# EAGLE design R2P_Sonar_module (EAGLE 6.2)
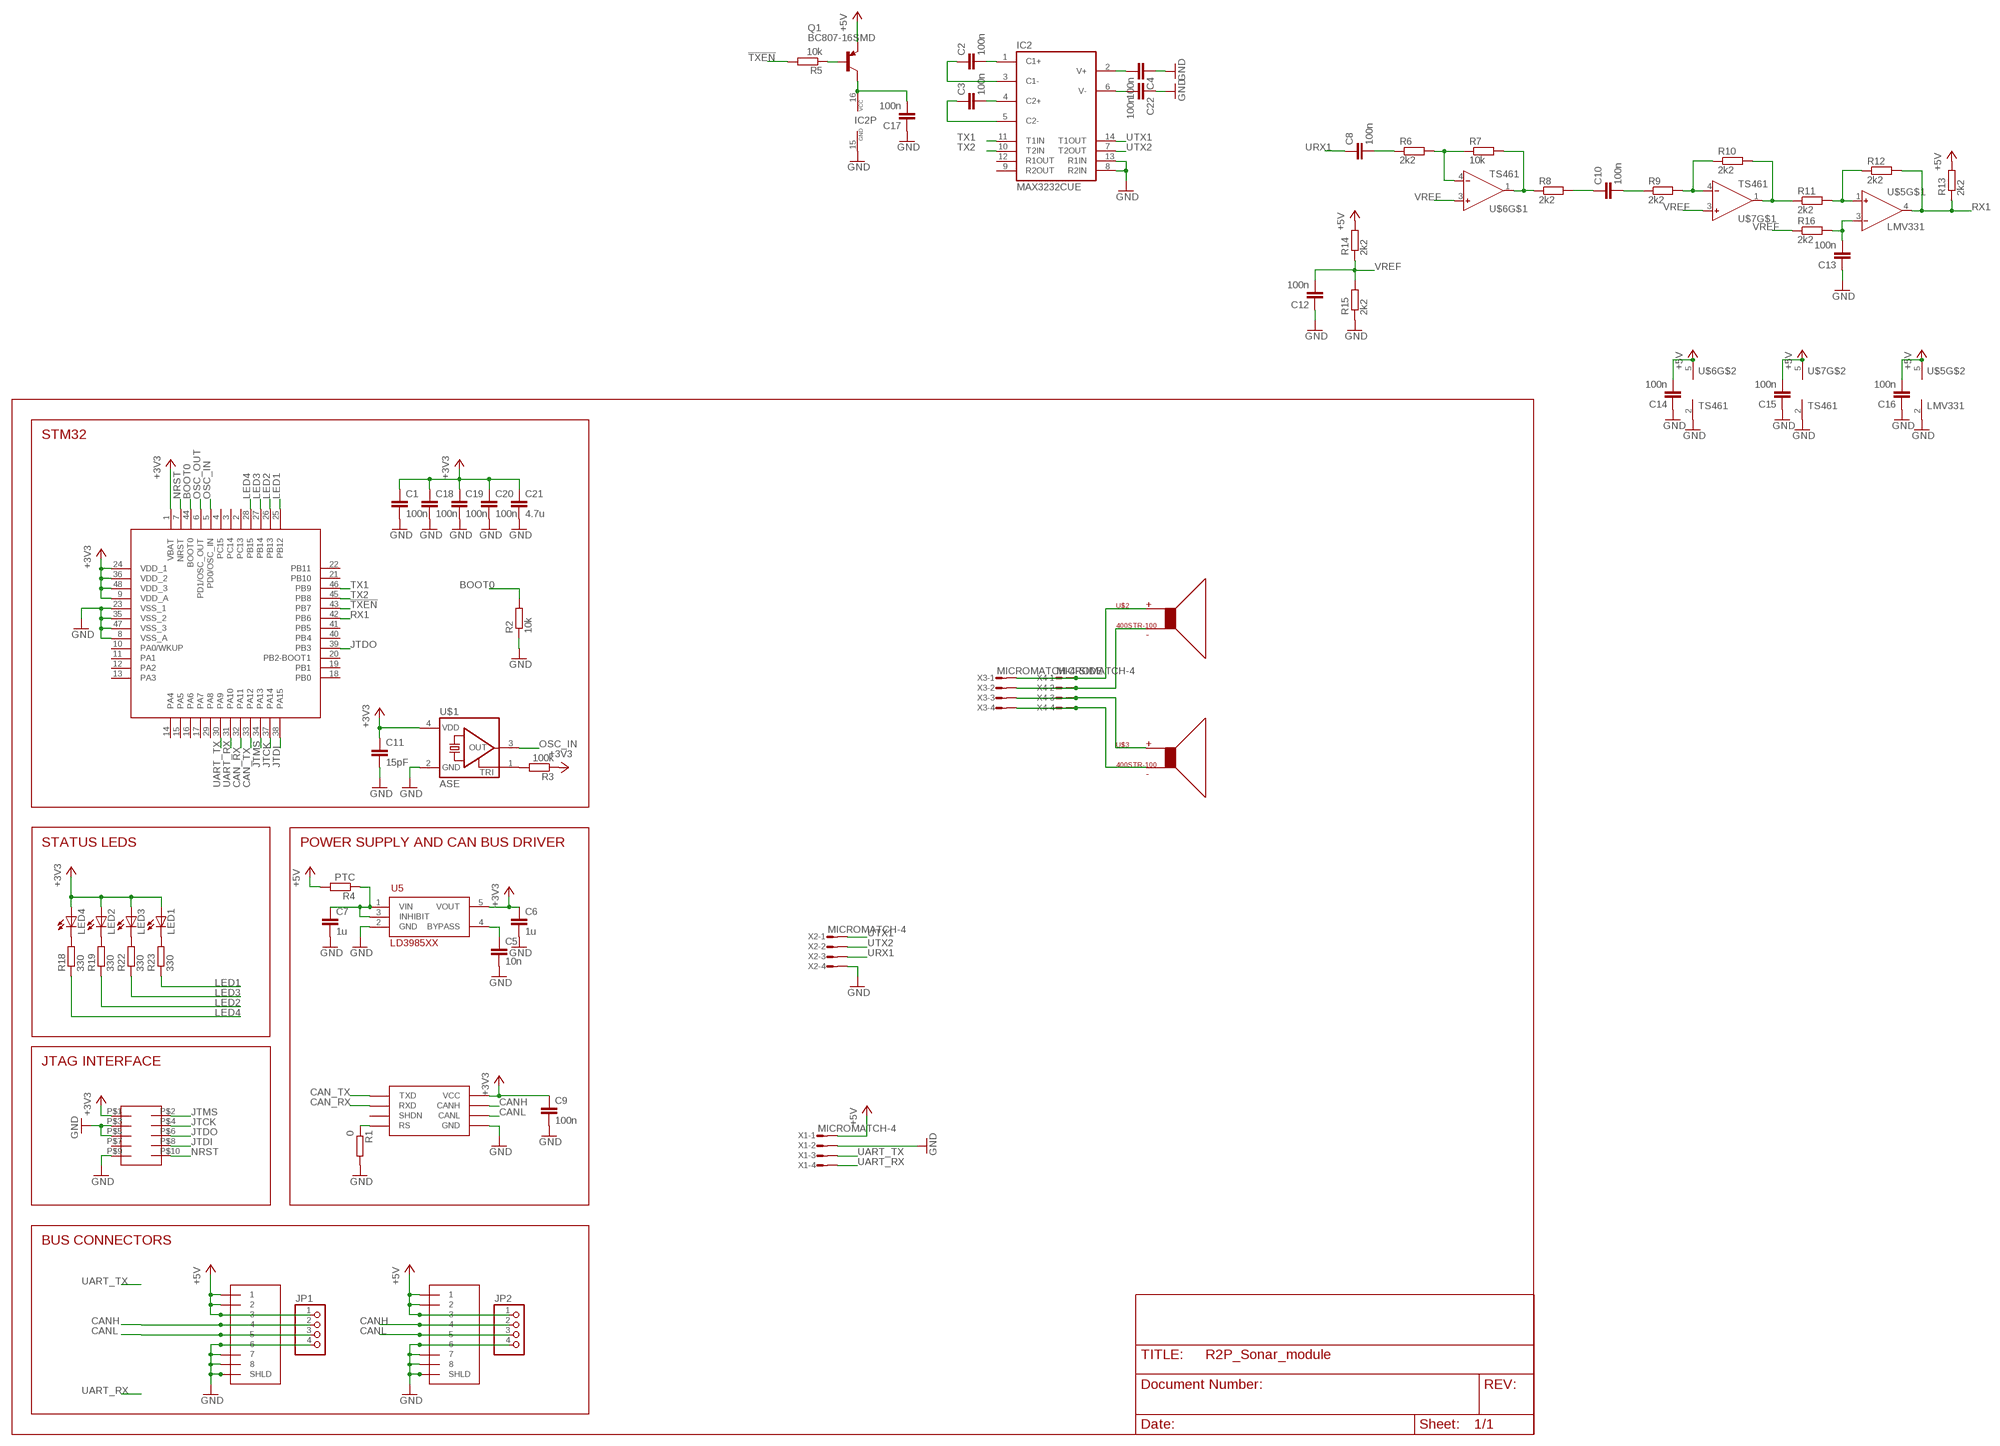
[diagram p0: schematic, sheet 1]

## Parts
1  RJ45-43860  [0438600010]
2  RJ45-43860  [0438600010]
C1  100n  C-EUC0603  [C0603]
C2  100n  C-EUC0603  [C0603]
C3  100n  C-EUC0603  [C0603]
C4  100n  C-EUC0603  [C0603]
C5  10n  C-EUC0603  [C0603]
C6  1u  C-EUC0603  [C0603]
C7  1u  C-EUC0603  [C0603]
C8  100n  C-EUC0603  [C0603]
C9  100n  C-EUC0603  [C0603]
C10  100n  C-EUC0603  [C0603]
C11  15pF  C-EUC0603  [C0603]
C12  100n  C-EUC0603  [C0603]
C13  100n  C-EUC0603  [C0603]
C14  100n  C-EUC0603  [C0603]
C15  100n  C-EUC0603  [C0603]
C16  100n  C-EUC0603  [C0603]
C17  100n  C-EUC0603  [C0603]
C18  100n  C-EUC0603  [C0603]
C19  100n  C-EUC0603  [C0603]
C20  100n  C-EUC0603  [C0603]
C21  4.7u  C-EUC0805  [C0805]
C22  100n  C-EUC0603  [C0603]
IC2  MAX3232CUE  [TSSOP16]
JP1  PINHD-1X4  [1X04]
JP2  PINHD-1X4  [1X04]
LED1  LEDCHIPLED_0805  [CHIPLED_0805]
LED2  LEDCHIPLED_0805  [CHIPLED_0805]
LED3  LEDCHIPLED_0805  [CHIPLED_0805]
LED4  LEDCHIPLED_0805  [CHIPLED_0805]
Q1  BC807-16SMD  [SOT23-BEC]
R1  0  R-EU_R0603  [R0603]
R2  10k  R-EU_R0603  [R0603]
R3  100k  R-EU_R0603  [R0603]
R4  PTC  R-EU_R0603  [R0603]
R5  10k  R-EU_R0603  [R0603]
R6  2k2  R-EU_R0603  [R0603]
R7  10k  R-EU_R0603  [R0603]
R8  2k2  R-EU_R0603  [R0603]
R9  2k2  R-EU_R0603  [R0603]
R10  2k2  R-EU_R0603  [R0603]
R11  2k2  R-EU_R0603  [R0603]
R12  2k2  R-EU_R0603  [R0603]
R13  2k2  R-EU_R0603  [R0603]
R14  2k2  R-EU_R0603  [R0603]
R15  2k2  R-EU_R0603  [R0603]
R16  2k2  R-EU_R0603  [R0603]
R18  330  R-EU_R0603  [R0603]
R19  330  R-EU_R0603  [R0603]
R22  330  R-EU_R0603  [R0603]
R23  330  R-EU_R0603  [R0603]
SOT1  MAX3051  [SOT23-8L]
U1  STM32F103CX  [LQFP48]
U5  LD3985XX  [SOT23-5L]
U$1  ASE  [ASE]
U$2  400STR-100  [400STR100]
U$3  400STR-100  [400STR100]
U$4  FTSH-105  [FTSH-105]
U$5  LMV331  [SOT23-5L]
U$6  TS461  [SOT23-5L]
U$7  TS461  [SOT23-5L]
X1  MICROMATCH-4  [MICROMATCH-4]
X2  MICROMATCH-4  [MICROMATCH-4]
X3  MICROMATCH-4-SIDE  [MICROMATCH-4-SIDE]
X4  MICROMATCH-4  [MICROMATCH-4]

## Nets
!TXEN: R5.2 U1.43(PB7)
+3V3: C1.1 C6.1 C9.1 C11.1 C18.1 C19.1 C20.1 C21.1 LED1.A LED2.A LED3.A LED4.A R3.1 SOT1.P$3(VCC) U1.1(VBAT) U1.9(VDD_A) U1.24(VDD_1) U1.36(VDD_2) U1.48(VDD_3) U5.5(VOUT) U$1.4(VDD) U$4.P$1
+5V: 1.P$1 1.P$2 1.P$3 2.P$1 2.P$2 2.P$3 C14.2 C15.2 C16.2 JP1.1 JP2.1 Q1.E R4.2 R13.2 R14.2 U$5.5(V+) U$6.5(V+) U$7.5(V+) X1.1
BOOT0: R2.2 U1.44(BOOT0)
CAN_RX: SOT1.P$4(RXD) U1.32(PA11)
CAN_TX: SOT1.P$1(TXD) U1.33(PA12)
CANH: 1.P$4 2.P$4 JP1.2 JP2.2 SOT1.P$7(CANH)
CANL: 1.P$5 2.P$5 JP1.3 JP2.3 SOT1.P$6(CANL)
GND: 1.P$6 1.P$7 1.P$8 1.P$9(SHLD) 1.P$10 2.P$6 2.P$7 2.P$8 2.P$9(SHLD) 2.P$10 C1.2 C4.1 C5.2 C6.2 C7.2 C9.2 C11.2 C12.1 C13.1 C14.1 C15.1 C16.1 C17.1 C18.2 C19.2 C20.2 C21.2 C22.1 IC2.8(R2IN) IC2.13(R1IN) IC2.15(GND) JP1.4 JP2.4 R1.2 R2.1 R15.1 SOT1.P$2(GND) U1.8(VSS_A) U1.23(VSS_1) U1.35(VSS_2) U1.47(VSS_3) U5.2(GND) U$1.2(GND) U$4.P$3 U$4.P$5 U$4.P$9 U$5.2(V-) U$6.2(V-) U$7.2(V-) X1.2 X2.4
JTCK: U1.37(PA14) U$4.P$4
JTDI: U1.38(PA15) U$4.P$8
JTDO: U1.39(PB3) U$4.P$6
JTMS: U1.34(PA13) U$4.P$2
LED1: R23.1 U1.25(PB12)
LED2: R19.1 U1.26(PB13)
LED3: R22.1 U1.27(PB14)
LED4: R18.1 U1.28(PB15)
N$2: R1.1 SOT1.P$8(RS)
N$3: R3.2 U$1.1(TRI)
N$4: C5.1 U5.4(BYPASS)
N$5: C7.1 R4.1 U5.1(VIN) U5.3(INHIBIT)
N$6: C2.2 IC2.1(C1+)
N$7: C2.1 IC2.3(C1-)
N$8: C3.2 IC2.4(C2+)
N$9: C3.1 IC2.5(C2-)
N$10: C17.2 IC2.16(VCC) Q1.C
N$11: C8.2 R6.1
N$12: U$2.P$1 X3.1 X4.1
N$13: U$2.P$2 X3.2 X4.2
N$14: U$3.P$1 X3.3 X4.3
N$15: LED4.C R18.2
N$16: U$3.P$2 X3.4 X4.4
N$17: Q1.B R5.1
N$18: LED2.C R19.2
N$20: LED3.C R22.2
N$21: R6.2 R7.1 U$6.4(IN-)
N$22: LED1.C R23.2
N$23: R7.2 R8.1 U$6.1(OUT)
N$24: C10.1 R8.2
N$25: C10.2 R9.1
N$26: R9.2 R10.1 U$7.4(IN-)
N$27: R10.2 R11.1 U$7.1(OUT)
N$28: R11.2 R12.1 U$5.1(IN+)
N$29: C4.2 IC2.2(V+)
N$30: C13.2 R16.2 U$5.3(IN-)
N$31: C22.2 IC2.6(V-)
NRST: U1.7(NRST) U$4.P$10
OSC_IN: U1.5(PD0/OSC_IN) U$1.3(OUT)
OSC_OUT: U1.6(PD1/OSC_OUT)
RX1: R12.2 R13.1 U1.42(PB6) U$5.4(OUT)
TX1: IC2.11(T1IN) U1.46(PB9)
TX2: IC2.10(T2IN) U1.45(PB8)
UART_RX: U1.31(PA10) X1.4
UART_TX: U1.30(PA9) X1.3
URX1: C8.1 X2.3
UTX1: IC2.14(T1OUT) X2.1
UTX2: IC2.7(T2OUT) X2.2
VREF: C12.2 R14.1 R15.2 R16.1 U$6.3(IN+) U$7.3(IN+)
Unconnected: IC2.9(R2OUT) IC2.12(R1OUT) SOT1.P$5(SHDN) U1.2(PC13) U1.3(PC14) U1.4(PC15) U1.10(PA0/WKUP) U1.11(PA1) U1.12(PA2) U1.13(PA3) U1.14(PA4) U1.15(PA5) U1.16(PA6) U1.17(PA7) U1.18(PB0) U1.19(PB1) U1.20(PB2-BOOT1) U1.21(PB10) U1.22(PB11) U1.29(PA8) U1.40(PB4) U1.41(PB5) U$4.P$7

## Notes on the sheet
- STM32
- STATUS LEDS | POWER SUPPLY AND CAN BUS DRIVER
- JTAG INTERFACE
- BUS CONNECTORS

## Library data of the parts
1 2 = molex:RJ45-43860
C1-C22 = rcl:C-EU: CAPACITOR, European symbol
IC2 = maxim:MAX3232*: True RS-232 Transceivers 3.0V to 5.5V, Low-Power up to 1Mbps, Using Four 0.1µF External Capacitors Source: http://pdfserv.maxim-ic.com/en/ds/MAX3222-MAX3241.pdf; MF: MAXIM; MPN: MAX3232CUE+; OC_FARNELL: 1593350; OC_NEWARK: 68K4629
JP1 JP2 = misc:PINHD-1X4: PIN HEADER
LED1-LED4 = led:LED: LED OSRAM: - CHIPLED LG R971, LG N971, LY N971, LG Q971, LY Q971, LO R971, LY R971 LH N974, LH R974 LS Q976, LO Q976, LY Q976 LO Q996 - Hyper CHIPLED LW Q18S LB Q993, LB Q99A, LB R99A - SideLED LS A670, LO A670, LY A670, LG A670, LP A670 LB A673, LV A673, LT A673, LW A673 LH A674 LY A675 LS A676, LA A676, LO A676, LY A676, LW A676 LS A679, LY A679, LG A679 - Hyper Micro SIDELED® LS Y876, LA Y876, LO Y876, LY Y876 LT Y87S - SmartLED LW L88C, LW L88S LB L89C, LB L89S, LG L890 LS L89K, LO L89K, LY L89K LS L896, LA L896, LO L896, LY L896 - TOPLED LS T670, LO T670, LY T670, LG T670, LP T670 LSG T670, LSP T670, LSY T670, LOP T670, LYG T670 LG T671, LOG T671, LSG T671 LB T673, LV T673, LT T673, LW T673 LH T674 LS T676, LA T676, LO T676, LY T676, LB T676, LH T676, LSB T676, LW T676 LB T67C, LV T67C, LT T67C, LS T67K, LO T67K, LY T67K, LW E67C LS E67B, LA E67B, LO E67B, LY E67B, LB E67C, LV E67C, LT E67C LW T67C LS T679, LY T679, LG T679 LS T770, LO T770, LY T770, LG T770, LP T770 LB T773, LV T773, LT T773, LW T773 LH T774 LS E675, LA E675, LY E675, LS T675 LS T776, LA T776, LO T776, LY T776, LB T776 LHGB T686 LT T68C, LB T68C - Hyper Mini TOPLED® LB M676 - Mini TOPLED Santana® LG M470 LS M47K, LO M47K, LY M47K Source: http://www.osram.convergy.de LUXEON: - LUMILED® LXK2-PW12-R00, LXK2-PW12-S00, LXK2-PW14-U00, LXK2-PW14-V00 LXK2-PM12-R00, LXK2-PM12-S00, LXK2-PM14-U00 LXK2-PE12-Q00, LXK2-PE12-R00, LXK2-PE12-S00, LXK2-PE14-T00, LXK2-PE14-U00 LXK2-PB12-K00, LXK2-PB12-L00, LXK2-PB12-M00, LXK2-PB14-N00, LXK2-PB14-P00, LXK2-PB14-Q00 LXK2-PR12-L00, LXK2-PR12-M00, LXK2-PR14-Q00, LXK2-PR14-R00 LXK2-PD12-Q00, LXK2-PD12-R00, LXK2-PD12-S00 LXK2-PH12-R00, LXK2-PH12-S00 LXK2-PL12-P00, LXK2-PL12-Q00, LXK2-PL12-R00 Source: www.luxeon.com KINGBRIGHT: KA-3528ASYC Source: www.kingbright.com
Q1 = transistor-pnp:BC807*: PNP Transistror
R1-R16 R18 R19 R22 R23 = rcl:R-EU_: RESISTOR, European symbol
SOT1 = maxim:MAX3051
U1 = st:STM32F103CX
U5 = st:LD3985XX
U$1 = crystal:ASE: 3.3Vdc CMOS SMD CRYSTAL CLOCK OSCILLATOR SOurce: www.abracon.com; OC_FARNELL: unknown; OC_NEWARK: unknown
U$2 U$3 = prowave:400STR
U$4 = samtec:FTSH-105
U$5 = texas-instruments:LMV331
U$6 U$7 = st:TS461
X1 X2 X4 = tyco:MICROMATCH-4: MicroMaTch 4
X3 = apbteam_con-amp-micromatch:MICROMATCH-4: MicroMaTch 4

## Board
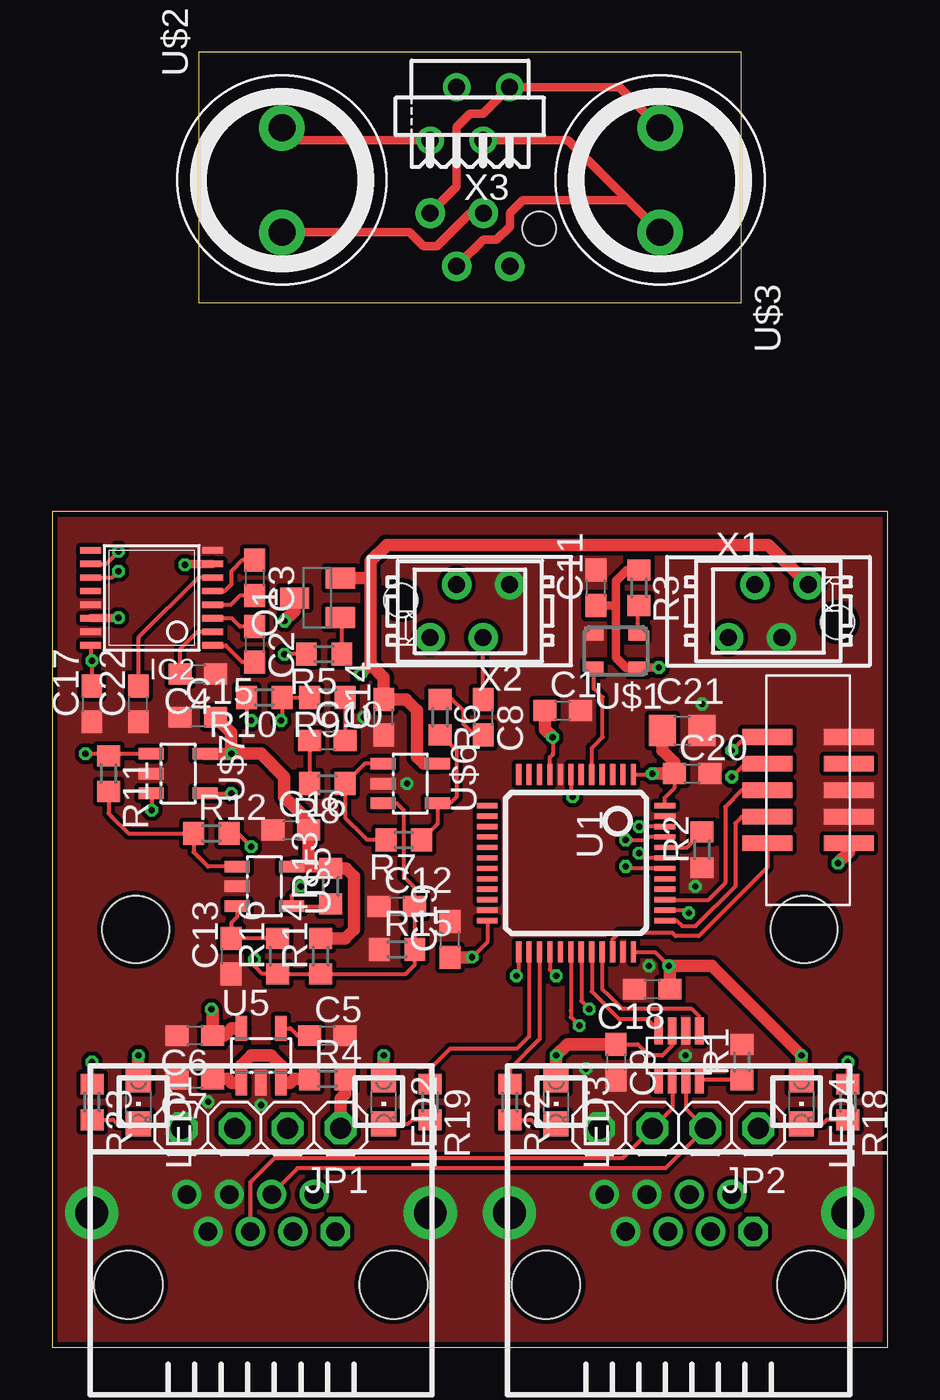
[diagram p1: board, top side]
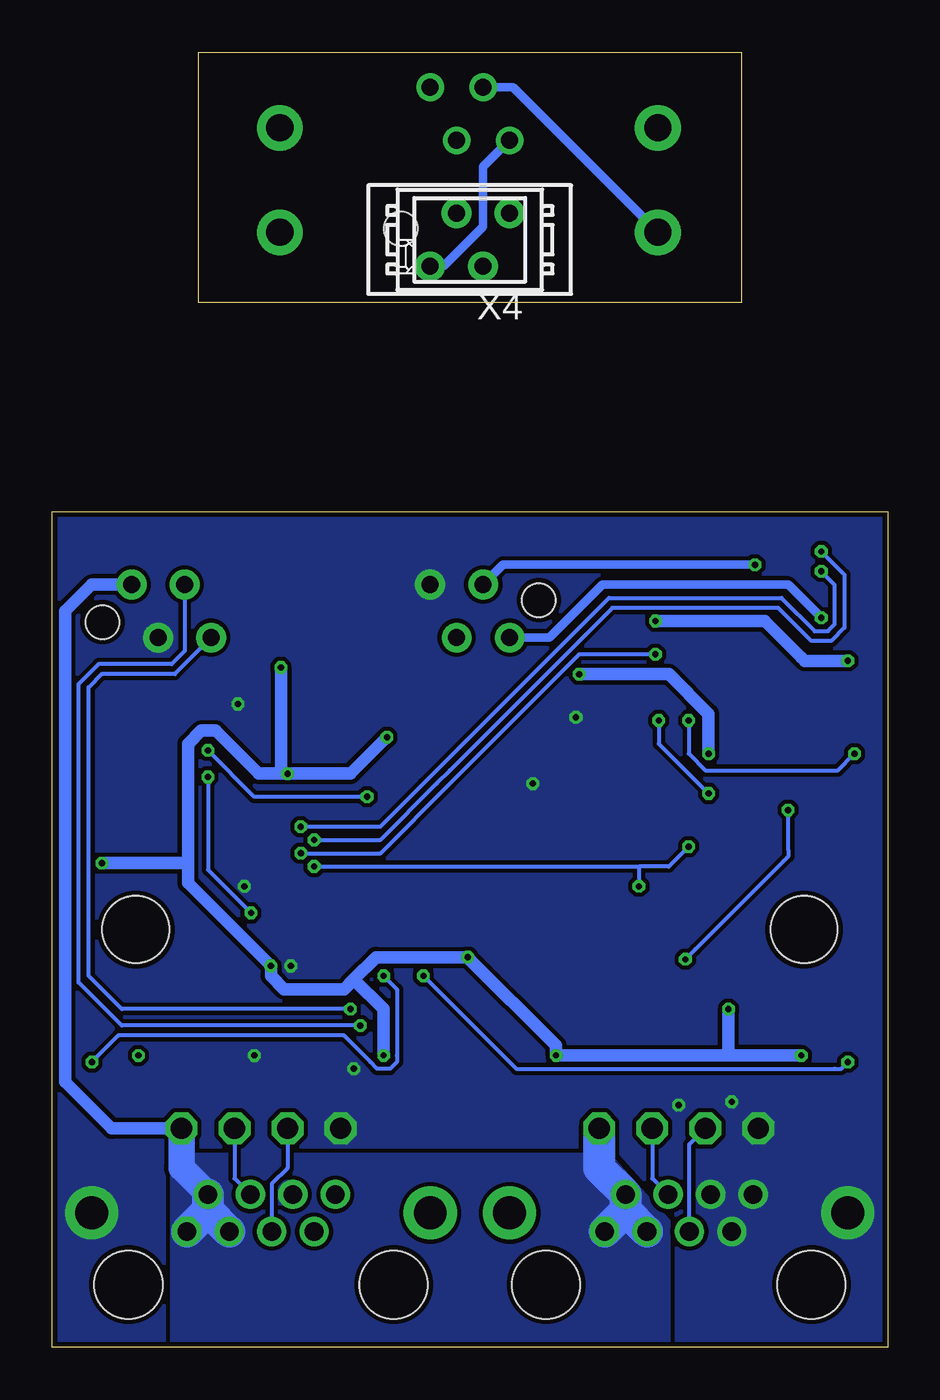
[diagram p2: board, bottom side, seen from below]

Size 40 x 62 mm. Coordinates in mm from the lower left corner, seen from the top.
Outline: 0,0 40,0 40,40 0,40 0,0
Outline: 7,50 33,50 33,62 7,62 7,50
Copper layers (1*16): Top 0.035mm / dielectric 1.5mm / Bottom 0.035mm
Design rules: minimum track width 8mil, minimum drill 0.3mm, track to track 8mil, track to pad 8mil, pad to pad 8mil, via to via 8mil, smd to smd 0mil, copper to edge 10mil, drill to drill 10mil, minimum pad ring 10mil, minimum via ring 6mil, stop-mask expansion 2mil, vias tented up to drill 100mil, thermal gap 10mil
Holes 3.2 mm at 4,20 36,20

### Footprints (pad centres in the part's own frame; a part is rotated, then mirrored left to right if it is on the bottom)
0438600010 = drill 0.889 octagon: P$1 3.556,2.54 | drill 0.889: P$2 2.54,4.318; P$3 1.524,2.54; P$4 0.508,4.318; P$5 -0.508,2.54; P$6 -1.524,4.318; P$7 -2.54,2.54; P$8 -3.556,4.318 | drill 1.575 pad 2.54: P$9 8.103,3.429; P$10 -8.103,3.429 | hole 3.251: -6.35,0; 6.35,0
C0603 = smd 1.1 x 1: 1 -0.85,0; 2 0.85,0
C0805 = smd 1.3 x 1.5: 1 -0.95,0; 2 0.95,0
TSSOP16 = smd 0.305 x 0.991: 1 -2.275,-2.918; 2 -1.625,-2.918; 3 -0.975,-2.918; 4 -0.325,-2.918; 5 0.325,-2.918; 6 0.975,-2.918; 7 1.625,-2.918; 8 2.275,-2.918; 9 2.275,2.918; 10 1.625,2.918; 11 0.975,2.918; 12 0.325,2.918; 13 -0.325,2.918; 14 -0.975,2.918; 15 -1.625,2.918; 16 -2.275,2.918
1X04 = drill 1.016 octagon: 1 -3.81,0; 2 -1.27,0; 3 1.27,0; 4 3.81,0
CHIPLED_0805 = smd 1.2 x 1.2: A 0,-1.05; C 0,1.05
SOT23-BEC = smd 1 x 1.4: B -0.95,-1.1; C 0,1.1; E 0.95,-1.1
R0603 = smd 1 x 1.1: 1 -0.85,0; 2 0.85,0
SOT23-8L = smd 1.3 x 0.42: P$1 -1.175,1.3; P$2 -1.175,0.65; P$3 -1.175,0; P$4 -1.175,-0.65; P$5 1.175,-0.65; P$6 1.175,0; P$7 1.175,0.65; P$8 1.175,1.3
LQFP48 = smd 1 x 0.25: 1 -4.25,2.75; 2 -4.25,2.25; 3 -4.25,1.75; 4 -4.25,1.25; 5 -4.25,0.75; 6 -4.25,0.25; 7 -4.25,-0.25; 8 -4.25,-0.75; 9 -4.25,-1.25; 10 -4.25,-1.75; 11 -4.25,-2.25; 12 -4.25,-2.75; 25 4.25,-2.75; 26 4.25,-2.25; 27 4.25,-1.75; 28 4.25,-1.25; 29 4.25,-0.75; 30 4.25,-0.25; 31 4.25,0.25; 32 4.25,0.75; 33 4.25,1.25; 34 4.25,1.75; 35 4.25,2.25; 36 4.25,2.75 | smd 0.25 x 1: 13 -2.75,-4.25; 14 -2.25,-4.25; 15 -1.75,-4.25; 16 -1.25,-4.25; 17 -0.75,-4.25; 18 -0.25,-4.25; 19 0.25,-4.25; 20 0.75,-4.25; 21 1.25,-4.25; 22 1.75,-4.25; 23 2.25,-4.25; 24 2.75,-4.25; 37 2.75,4.25; 38 2.25,4.25; 39 1.75,4.25; 40 1.25,4.25; 41 0.75,4.25; 42 0.25,4.25; 43 -0.25,4.25; 44 -0.75,4.25; 45 -1.25,4.25; 46 -1.75,4.25; 47 -2.25,4.25; 48 -2.75,4.25
SOT23-5L = smd 0.55 x 1.2: 1 -0.95,-1.3; 2 0,-1.3; 3 0.95,-1.3; 4 0.95,1.3; 5 -0.95,1.3
ASE = smd 0.9 x 0.65: 1 -1.05,-0.825; 2 1.05,-0.825; 3 1.05,0.825; 4 -1.05,0.825
400STR100 = drill 1.3 pad 2.184: P$1 2.5,0; P$2 -2.5,0
FTSH-105 = smd 0.76 x 2.4: P$1 -2.54,-1.95; P$2 -2.54,1.95; P$3 -1.27,-1.95; P$4 -1.27,1.95; P$5 0,-1.95; P$6 0,1.95; P$7 1.27,-1.95; P$8 1.27,1.95; P$9 2.54,-1.95; P$10 2.54,1.95
MICROMATCH-4 = drill 0.813 pad 1.422: 1 1.905,1.27; 2 0.635,-1.27; 3 -0.635,1.27; 4 -1.905,-1.27 | hole 1.6: 3.305,-0.53
MICROMATCH-4-SIDE = drill 0.813: 1 1.905,1.27; 2 0.635,-1.27; 3 -0.635,1.27; 4 -1.905,-1.27

### Placement (x,y rotation side)
1  30,3 0 top
2  10,3 0 top
C1  24.45,30.48 0 top
C2  9.68,33.66 270 top
C3  9.68,36.83 270 top
C4  6.99,32.23 180 top
C5  13.18,14.92 0 top
C6  6.83,14.92 180 top
C7  6.83,12.86 180 top
C8  20.64,30.16 270 top
C9  26.99,13.65 270 top
C10  13.18,29.05 0 top
C11  26.04,36.35 90 top
C12  16.51,21.11 0 top
C13  8.57,18.73 90 top
C14  15.88,30.16 90 top
C15  6.99,30.16 0 top
C16  11.43,24.77 0 top
C17  1.91,30.8 90 top
C18  28.73,17.14 180 top
C19  19.05,19.53 90 top
C20  30.64,27.46 0 top
C21  30.16,29.53 0 top
C22  4.13,30.8 90 top
IC2  4.76,35.88 90 top
JP1  10,10.48 180 top
JP2  30,10.48 180 top
LED1  4.13,11.75 180 top
LED2  15.88,11.75 180 top
LED3  24.13,11.75 180 top
LED4  35.88,11.75 180 top
Q1  12.7,35.88 90 top
R1  33.02,13.65 90 top
R2  31.11,23.81 90 top
R3  28.1,36.35 270 top
R4  13.18,12.86 0 top
R5  13.02,33.18 180 top
R6  18.57,30.16 270 top
R7  16.83,24.29 180 top
R8  13.18,26.99 180 top
R9  13.18,31.11 180 top
R10  10.16,31.11 180 top
R11  2.7,27.46 270 top
R12  7.62,24.61 0 top
R13  13.34,22.07 90 top
R14  12.86,18.73 90 top
R15  16.51,19.05 0 top
R16  10.79,18.73 90 top
R18  38.1,11.75 270 top
R19  18.1,11.75 270 top
R22  21.91,11.75 270 top
R23  1.91,11.75 270 top
SOT1  29.69,13.97 270 top
U1  25.08,23.18 270 top
U5  10,13.97 0 top
U$1  26.99,33.34 180 top
U$2  11,55.88 90 top
U$3  29.1,55.88 270 top
U$4  36.2,26.67 90 top
U$5  10.16,22.07 270 top
U$6  17.14,26.99 270 top
U$7  6.03,27.46 270 top
X1  34.29,35.24 0 top
X2  20,35.24 180 top
X3  20,59.05 180 top
X4  20,53.02 180 bottom

### Tracks (layer width: path | path; a pad name or v marks a point on that pad's centre or on a via)
!TXEN  (via drill 0.3)
  Top 0.203: R5.2 v11.11,33.18 | U1.43 28.32,23.43 v28.1,23.65
  Bottom 0.203: v11.11,33.18 14.76,33.18 20.95,26.99 24.29,23.65 v28.1,23.65
+3V3  (via drill 0.3)
  Top 0.203: SOT1.P$3 29.69,14.45 29.21,13.97 28.57,13.97 28.26,14.29 28.04,14.5 C9.1 | 8.6,15.27 8.57,15.24 | U1.24 20.83,19.4 v20.11,18.68 | U1.36 28.86,18.93 v29.53,18.26 | v23.97,29.21 23.97,28.42 23.97,28.38 23.83,28.24 U1.9 | U1.1 28.7,27.43 v28.73,27.46 | U1.48 29.33,26.32 29.79,26.77 C20.1
  Top 0.406: 26.99,35.5 26.99,33.02 27.5,32.51 U$1.4 28.07,32.54 v29.05,32.54 | 26.99,35.5 C11.1 | R3.1 27.52,37.2 26.99,36.67 26.99,35.5
  Top 0.61: U5.5 8.6,15.27 | 8.57,15.24 8.26,14.92 C6.1 7.68,16.14 v7.62,16.19 | LED1.A v4.13,13.97 | LED2.A v15.88,13.97 | LED3.A v24.13,13.97 24.66,14.5 C9.1 | LED4.A v35.88,13.97 31.59,18.26 v29.53,18.26 29.58,18.26 C18.1 | C1.1 23.6,29.58 v23.97,29.21 | C19.1 v20.11,18.68 | v37.62,23.18 38.15,23.7 38.15,24.02 U$4.P$1 | v28.73,27.46 C20.1 29.79,28 29.21,28.57 C21.1
  Bottom 0.61: 7.62,13.97 v7.62,16.19 | v4.13,13.97 7.62,13.97 | 7.62,13.97 v15.88,13.97 15.88,14.45 v20.11,18.68 24.5,18.68 25.56,17.62 | 33.5,23.18 33.5,22.23 v29.53,18.26 29.53,17.78 28.89,17.14 26.04,17.14 25.56,17.62 | 33.5,23.18 33.5,28.89 32.86,29.53 32.7,29.53 32.17,29.53 30.11,27.46 v28.73,27.46 | v37.62,23.18 33.5,23.18 | v24.13,13.97 24.13,16.19 25.56,17.62 | v28.73,27.46 25.72,27.46 v23.97,29.21 | v29.05,32.54 29.05,27.46 v28.73,27.46
+5V  (via drill 0.3)
  Top 0.203: 13.23,23.02 R13.2
  Top 0.61: R4.2 14.03,12.12 13.81,11.9 JP1.1 | X1.1 34.29,38.42 16.02,38.42 15.24,37.63 15.24,37.47 15.24,36.83 | U$6.5 17.78,27.94 17.46,28.26 17.46,30.48 16.93,31.01 C14.2 15.88,32.07 15.24,32.7 | 13.23,23.02 12.38,23.02 12.06,23.02 | 12.06,23.02 U$5.5 | R13.2 14.07,22.92 14.45,22.54 14.45,20 14.03,19.58 R14.2 | Q1.E 15.24,36.83 | U$7.5 v8.57,28.41 v8.57,28.42 | C15.2 8.57,29.43 v8.57,28.42 | 15.24,36.83 15.24,32.7 | 15.24,32.7 v14.76,32.23 | v8.57,28.42 10,28.42 11.11,27.3 11.11,26.35 11.75,25.72 12.28,25.18 C16.2 12.28,23.02 12.06,23.02
  Bottom 0.61: JP2.1 37.15,10.48 39.37,12.7 39.37,35.24 38.1,36.51 X1.1 | v14.76,32.23 10.48,32.23 8.57,30.32 v8.57,28.42
  Bottom 1.27: JP2.1 33.81,8.59 1.P$2
  Bottom 1.524: JP1.1 13.81,8.59 2.P$2 12.54,6.56 | 12.54,6.56 2.P$1 | 2.P$3 12.54,6.56 | 1.P$1 32.54,6.56 | 1.P$3 32.54,6.56 | 32.54,6.56 1.P$2
  pour Bottom (no thermals): 10.48,0 10.48,6.03 13.34,9.21 34.29,9.21 34.29,0
BOOT0
  Top 0.203: U1.44 30.38,23.93 R2.2
CAN_RX
  Top 0.203: U1.32 25.83,17.03 27.15,15.72 28.46,15.72 SOT1.P$4
CAN_TX
  Top 0.203: U1.33 26.33,17.16 26.67,16.83 27.3,16.19 30.64,16.19 30.99,15.85 SOT1.P$1
CANH
  Top 0.203: 2.P$4 10.51,7.33 11.75,8.57 29.37,8.57 JP2.2 30.34,11.41 SOT1.P$7
  Bottom 0.203: JP1.2 11.27,8.08 2.P$4 | JP2.2 31.27,8.08 1.P$4
CANL
  Top 0.203: SOT1.P$6 29.69,11.43 JP2.3 27.3,9.05 11.75,9.05 10.64,9.05 9.53,7.94 9.49,7.9 2.P$5
  Bottom 0.203: 1.P$5 29.49,7.81 28.73,8.57 JP2.3 | 2.P$5 9.49,9.72 JP1.3
GND  (via drill 0.3)
  other vias: 30.8,22.07 30.32,13.97 10,11.59 7.46,11.75 31.11,30.8 28.57,18.26 25.56,13.34 16.99,26.99 14.92,30.16
  pour Bottom (rank 6, no thermals): 0,0 40,0 40,40 0,40
  pour Top (rank 6, no thermals): 0,0 40,0 40,40 0,40
JTCK
  Top 0.203: U1.37 29.9,20.43 30.16,20.16 30.8,20.16 32.7,22.07 32.7,25.08 33.02,25.4 33.18,25.4 U$4.P$4
JTDI  (via drill 0.3)
  Top 0.203: U$4.P$8 33.18,27.94 v32.54,27.3 | U1.38 30.35,20.93 v30.48,20.8
  Bottom 0.203: v32.54,27.3 32.54,22.86 v30.48,20.8
JTDO
  Top 0.203: U$4.P$6 33.02,26.67 32.23,25.88 32.23,22.23 31.43,21.43 U1.39
JTMS
  Top 0.203: U1.34 26.83,19.53 27.15,19.84 29.69,19.84 29.84,19.68 30.96,19.68 34.24,22.97 U$4.P$2
LED1  (via drill 0.3)
  Top 0.203: U1.25 22.33,17.89 v22.23,17.78 | R23.1 v1.91,13.65
  Bottom 0.203: v22.23,17.78 17.78,13.34 2.54,13.34 2.22,13.34 v1.91,13.65
LED2
  Top 0.203: U1.26 22.83,14.89 22.23,14.29 19.05,14.29 18.1,13.34 R19.1
LED3
  Top 0.203: U1.27 23.33,14.76 21.91,13.34 R22.1
LED4  (via drill 0.3)
  Top 0.203: U1.28 23.83,18.08 v24.13,17.78 | R18.1 v38.1,13.65
  Bottom 0.203: v24.13,17.78 23.5,17.14 23.5,13.97 23.5,13.65 23.81,13.34 24.45,13.34 24.77,13.65 26.04,14.92 36.83,14.92 v38.1,13.65
N$2
  Top 0.203: R1.1 30.99,12.8 SOT1.P$8
N$3
  Top 0.203: U$1.1 28.04,35.6 R3.2
N$4
  Top 0.203: U5.4 11.4,15.27 11.43,15.24 11.75,14.92 C5.1
N$5
  Top 0.203: 8.6,12.67 8.57,12.7 | 11.4,12.67 11.43,12.7
  Top 0.61: 8.6,12.67 U5.1 9.05,13.5 9.53,13.97 10.48,13.97 10.95,13.5 U5.3 11.4,12.67 | C7.1 8.41,12.86 8.57,12.7 | R4.1 11.59,12.86 11.43,12.7
N$6
  Top 0.203: IC2.1 8.31,33.6 9.11,32.8 C2.2
N$7
  Top 0.203: IC2.3 8.6,34.9 8.99,34.51 C2.1
N$8
  Top 0.203: IC2.4 8.56,35.55 8.99,35.98 C3.2
N$9
  Top 0.203: C3.1 9.11,37.68 8.57,37.15 8.57,36.51 8.26,36.2 8.25,36.2 IC2.5
N$10  (via drill 0.3)
  Top 0.203: IC2.16 1.84,32.92 v1.91,32.86 C17.2
  Top 0.61: Q1.C 11.6,35.25 v11.11,34.77
  Bottom 0.61: v11.11,34.77 5.87,34.77 4.13,33.02 3.97,32.86 v1.91,32.86
N$11
  Top 0.203: R6.1 19.15,31.01 19.68,30.48 19.68,29.84 20.22,29.31 C8.2
N$12
  Top 0.406: X3.1 11.6,57.78 U$2.P$1
  Bottom 0.406: X4.1 21.27,51.75 19.37,53.66 19.37,56.51 X3.1
N$13
  Top 0.406: U$2.P$2 17.11,53.38 17.78,52.7 18.41,52.7 20,54.29 X4.2
  Bottom 0.406: X3.2 17.95,60.33 U$2.P$2
N$14
  Top 0.406: X3.3 24.7,57.78 U$3.P$1 27.55,54.93 22.54,54.93 21.91,54.29 21.91,53.66 21.27,53.02 20.95,53.02 20.64,53.02 X4.3
N$15
  Top 0.203: LED4.C 36.89,10.7 37.09,10.9 R18.2
N$16
  Top 0.406: U$3.P$2 27.16,60.33 X3.4 20.64,59.05 20,59.05 19.37,58.42 19.37,55.56 X4.4
N$17
  Top 0.203: R5.1 13.87,34.86 Q1.B
N$18
  Top 0.203: LED2.C 17.05,10.7 17.25,10.9 R19.2
N$20
  Top 0.203: R22.2 22.92,10.9 23.12,10.7 LED3.C
N$21
  Top 0.203: R7.1 18.45,25.06 U$6.4 19.05,26.04 19.37,26.35 19.37,28.57 18.63,29.31 R6.2
N$22
  Top 0.203: LED1.C 3.11,10.7 2.91,10.9 R23.2
N$23
  Top 0.203: U$6.1 14.98,27.94 R8.1 14.03,26.61 14.03,25.34 14.92,24.45 15.08,24.29 R7.2
N$24
  Top 0.203: C10.1 R8.2
N$25
  Top 0.203: R9.1 C10.2
N$26  (via drill 0.3)
  Top 0.203: R9.2 R10.1 11.01,30.06 v10.95,30 | U$7.4 v8.57,26.51
  Bottom 0.203: v10.95,30 10.95,28.89 v8.57,26.51
N$27  (via drill 0.3)
  Top 0.203: U$7.1 2.8,28.41 R11.1 2.6,28.42 v1.59,28.42 | R10.2 9.31,30.22 v9.53,30
  Bottom 0.203: v9.53,30 9.53,28.42 8.73,27.62 2.38,27.62 v1.59,28.42
N$28
  Top 0.203: R11.2 2.7,25.56 2.86,25.4 3.65,24.61 R12.1 6.77,23.71 6.99,23.5 7.46,23.02 U$5.1
N$29
  Top 0.203: IC2.2 6.95,34.25 6.35,33.66 6.13,33.44 C4.2
N$30
  Top 0.203: R16.2 C13.2 8.57,20.32 8.86,20.61 U$5.3
N$31
  Top 0.203: IC2.6 7.01,36.85 4.13,33.97 C22.2
NRST  (via drill 0.3)
  Top 0.203: U1.7 24.83,26.44 v24.92,26.35 | U$4.P$10 33.18,29.21 v32.54,28.57
  Bottom 0.203: v24.92,26.35 30.32,26.35 v32.54,28.57
OSC_IN
  Top 0.203: U1.5 25.83,28.69 26.04,28.89 26.35,29.21 26.35,31.11 25.94,31.53 U$1.3
RX1  (via drill 0.3)
  Top 0.203: R13.1 13.23,21.12 U$5.4 11.46,21.62 v11.91,22.07 | U1.42 27.55,22.93 v27.46,23.02 | R12.2 8.89,24.61 v9.53,23.97
  Bottom 0.203: v27.46,23.02 11.91,23.02 | 11.91,23.02 v11.91,22.07 | v9.53,23.97 10.48,23.02 11.91,23.02
TX1  (via drill 0.3)
  Top 0.203: IC2.11 2.88,36.85 v3.17,37.15 | U1.46 v28.1,24.93
  Bottom 0.203: v3.17,37.15 2.54,36.51 2.54,34.61 2.86,34.29 3.49,34.29 5.08,35.88 13.34,35.88 22.23,26.99 24.29,24.93 v28.1,24.93
TX2  (via drill 0.3)
  Top 0.203: IC2.10 2.58,37.5 v3.17,38.1 | v27.46,24.29 28.42,24.29 28.55,24.43 U1.45
  Bottom 0.203: v3.17,38.1 2.06,36.99 2.06,34.45 2.7,33.81 3.65,33.81 5.24,35.4 12.86,35.4 13.18,35.4 20.95,27.62 21.59,26.99 24.29,24.29 v27.46,24.29
UART_RX  (via drill 0.3)
  Top 0.203: U1.31 25.33,16.58 v25.72,16.19
  Bottom 0.203: v25.72,16.19 36.67,16.19 38.26,17.78 38.26,31.59 37.62,32.23 34.13,32.23 X1.4
UART_TX  (via drill 0.3)
  Top 0.203: U1.30 24.83,16.12 24.83,15.81 v25.24,15.4
  Bottom 0.203: v25.24,15.4 36.67,15.4 38.73,17.46 38.73,31.75 37.78,32.7 34.29,32.7 33.66,33.34 X1.3
URX1
  Top 0.203: C8.1 X2.3
UTX1  (via drill 0.3)
  Top 0.406: IC2.14 3.15,34.9 v3.17,34.92
  Bottom 0.406: v3.17,34.92 4.76,36.51 13.65,36.51 16.19,33.97 X2.1
UTX2  (via drill 0.3)
  Top 0.406: v6.35,37.47 6.39,37.5 IC2.7
  Bottom 0.406: X2.2 18.41,37.47 v6.35,37.47
VREF  (via drill 0.3)
  Top 0.203: v9.68,18.57 9.68,18.26 10.06,17.88 R16.1 R14.1 16.93,17.88 17.14,18.1 17.36,18.31 R15.2 C12.2 17.36,22.01 17.14,22.23 16.83,22.54 16.83,25.72 16.51,26.04 U$6.3 | U$7.3 4.76,26.48 v4.76,25.72
  Bottom 0.203: v4.76,25.72 4.76,23.81 4.76,23.5 9.21,19.05 9.53,18.73 v9.68,18.57